# EAGLE design FuseReset_0.1 (EAGLE 7.2.1)
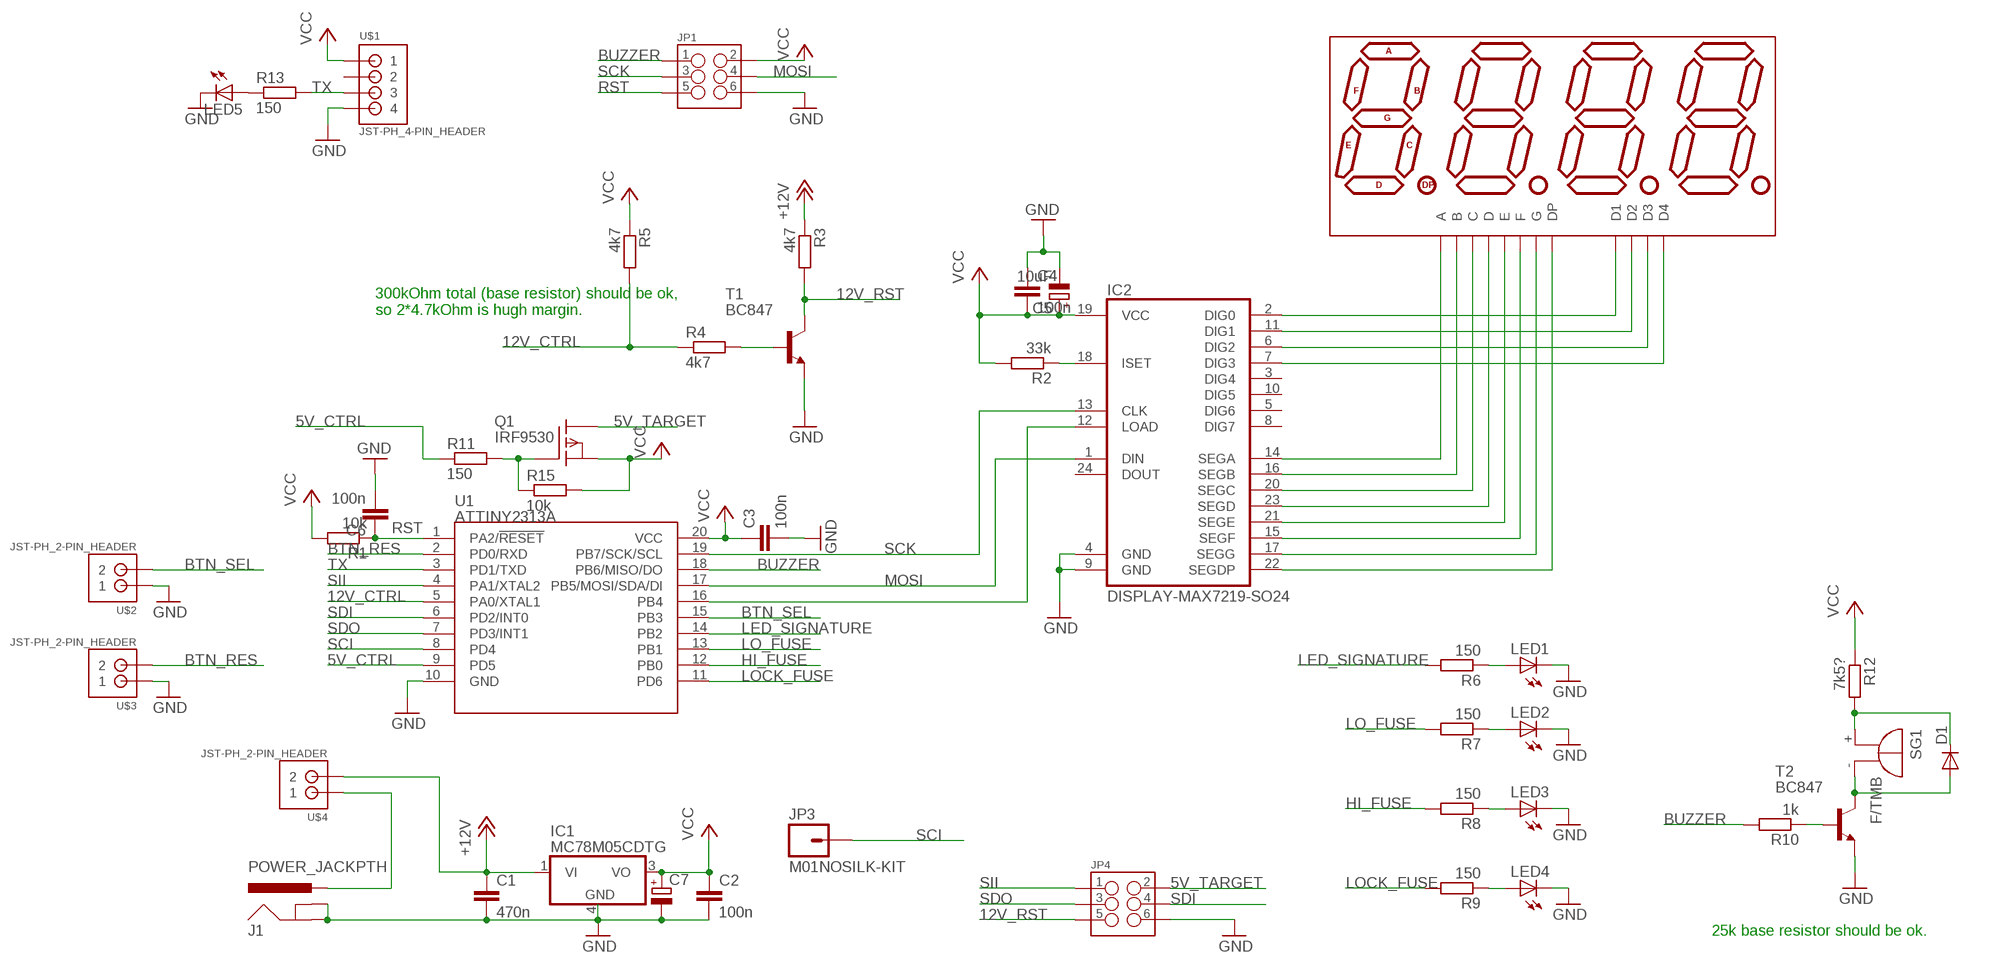
[diagram p0: schematic, sheet 1]

## Parts
C1  470n  C-EUC0805  [C0805]
C2  100n  C-EUC0805  [C0805]
C3  100n  C-EUC0805  [C0805]
C4  100n  C-EUC0805  [C0805]
C5  10uF  CPOL-EU153CLV-0405  [153CLV-0405]
C6  100n  C-EUC0805  [C0805]
C7  CPOL-EUE2-5  [E2-5]
D1  DIODE-DO-214AC  [DO-214AC]
DISP2  7-SEGMENT-4DIGIT-COUNTER  [7-SEGMENT-4DIGIT-COUNTER-0.36"]
IC1  MC78M05CDTG  [DPACK_3]
IC2  DISPLAY-MAX7219-SO24  [SO24L]
J1  POWER_JACKPTH  [POWER_JACK_PTH]
JP1  M03X2SHROUD  [2X3-SHROUDED]
JP3  M01NOSILK-KIT  [1X01NS-KIT]
JP4  M03X2SHROUD  [2X3-SHROUDED]
LED1  LED3MM  [LED3MM]
LED2  LED3MM  [LED3MM]
LED3  LED3MM  [LED3MM]
LED4  LED3MM  [LED3MM]
LED5  LED-0805  [LED-805]
Q1  IRF9530  [TO220]
R1  10k  R-EU_R0805  [R0805]
R2  33k  R-EU_R0805  [R0805]
R3  4k7  R-EU_R0805  [R0805]
R4  4k7  R-EU_R0805  [R0805]
R5  4k7  R-EU_R0805  [R0805]
R6  150  R-EU_R0805  [R0805]
R7  150  R-EU_R0805  [R0805]
R8  150  R-EU_R0805  [R0805]
R9  150  R-EU_R0805  [R0805]
R10  1k  R-EU_R0805  [R0805]
R11  150  R-EU_R0805  [R0805]
R12  7k5?  R-EU_R0805  [R0805]
R13  150  R-EU_R0805  [R0805]
R15  10k  R-EU_R0805  [R0805]
SG1  F/TMB  [F/TMB]
T1  BC847  [SOT23]
T2  BC847  [SOT23]
U1  ATTINY2313A  [SOP20W]
U$1  JST-PH_4-PIN_HEADER  [JST_B4B-PH_HEADER]
U$2  JST-PH_2-PIN_HEADER  [JST_B2B-PH_HEADER]
U$3  JST-PH_2-PIN_HEADER  [JST_B2B-PH_HEADER]
U$4  JST-PH_2-PIN_HEADER  [JST_B2B-PH_HEADER]

## Nets
5V_CTRL: R11.1 U1.9(PD5)
5V_TARGET: JP4.2 Q1.2(D)
12V_CTRL: R4.1 R5.2 U1.5(PA0/XTAL1)
12V_RST: JP4.5 R3.2 T1.3(C)
+12V: C1.1 IC1.1(VI) R3.1 U$4.P2
BTN_RES: U1.2(PD0/RXD) U$3.P2
BTN_SEL: U1.15(PB3) U$2.P2
BUZZER: JP1.1 R10.2 U1.18(PB6/MISO/DO)
GND: C1.2 C2.2 C3.2 C4.1 C5.- C6.2 C7.- IC1.4(GND) IC2.4(GND) IC2.9(GND) J1.GND J1.GNDBREAK JP1.6 JP4.6 LED1.K(C) LED2.K(C) LED3.K(C) LED4.K(C) LED5.C T1.2(E) T2.2(E) U1.10(GND) U$1.P4 U$2.P1 U$3.P1
HI_FUSE: R8.2 U1.12(PB0)
LED_SIGNATURE: R6.2 U1.14(PB2)
LO_FUSE: R7.2 U1.13(PB1)
LOCK_FUSE: R9.2 U1.11(PD6)
MOSI: IC2.1(DIN) JP1.4 U1.17(PB5/MOSI/SDA/DI)
N$1: DISP2.12(D1) IC2.2(DIG0)
N$2: DISP2.9(D2) IC2.11(DIG1)
N$3: DISP2.8(D3) IC2.6(DIG2)
N$4: DISP2.6(D4) IC2.7(DIG3)
N$5: DISP2.11(A) IC2.14(SEGA)
N$6: DISP2.7(B) IC2.16(SEGB)
N$7: DISP2.4(C) IC2.20(SEGC)
N$8: DISP2.2(D) IC2.23(SEGD)
N$9: DISP2.1(E) IC2.21(SEGE)
N$10: DISP2.10(F) IC2.15(SEGF)
N$11: DISP2.5(G) IC2.17(SEGG)
N$12: DISP2.3(DP) IC2.22(SEGDP)
N$13: IC2.18(ISET) R2.1
N$14: LED3.A R8.1
N$15: LED4.A R9.1
N$16: J1.PWR U$4.P1
N$17: LED2.A R7.1
N$18: LED1.A R6.1
N$19: R4.2 T1.1(B)
N$20: IC2.12(LOAD) U1.16(PB4)
N$23: R10.1 T2.1(B)
N$24: LED5.A R13.1
N$25: D1.2(A) SG1.- T2.3(C)
N$26: D1.1(C) R12.2 SG1.+
N$27: Q1.1(G) R11.2 R15.1
RST: C6.1 JP1.5 R1.1 U1.1(PA2/!RESET)
SCI: JP3.1 U1.8(PD4)
SCK: IC2.13(CLK) JP1.3 U1.19(PB7/SCK/SCL)
SDI: JP4.4 U1.6(PD2/INT0)
SDO: JP4.3 U1.7(PD3/INT1)
SII: JP4.1 U1.4(PA1/XTAL2)
TX: R13.2 U1.3(PD1/TXD) U$1.P3
VCC: C2.1 C3.1 C4.2 C5.+ C7.+ IC1.3(VO) IC2.19(VCC) JP1.2 Q1.3(S) R1.2 R2.2 R5.1 R12.1 R15.2 U1.20(VCC) U$1.P1
Unconnected: IC2.3(DIG4) IC2.5(DIG6) IC2.8(DIG7) IC2.10(DIG5) IC2.24(DOUT) U$1.P2

## Notes on the sheet
- 300kOhm total (base resistor) should be ok, 
  so 2*4.7kOhm is hugh margin.
- 25k base resistor should be ok.

## Library data of the parts
C1-C4 C6 = resistor:C-EU: CAPACITOR, European symbol
C5 = resistor:CPOL-EU: POLARIZED CAPACITOR, European symbol
C7 = rcl:CPOL-EU: POLARIZED CAPACITOR, European symbol
D1 = dp_devices:DIODE: Various Diode Packages
DISP2 = dea:7-SEGMENT-4DIGIT-COUNTER
IC1 = linear:MC78M: 500 mA Positive Voltage Regulators Source: Data sheet <http://www.onsemi.com/pub_link/Collateral/MC78M00-D.PDF>
IC2 = tidyeagle:DISPLAY-MAX7219: Maxim Serial LED Display Driver Datasheet: Full <http://datasheets.maxim-ic.com/en/ds/MAX7219-MAX7221.pdf> Application Notes: 7-Segment LED Displays used with this IC should be of the common cathode configuration. LED brightness is controlled by a resistor between ISET and VCC. A minimum value should be 9.53kΩ, which will typically allow a supply of 40mA. See Page 10/11 of the datasheet for more information on selecting a suitable resistor. A 10µF electrolytic bypass capacitor should used in addition to the standard 0.1µF ceramic capacitor to mitigate the effects of power supply ripple. Supports the following chips - MAX7219 MAX7221
J1 = SparkFun-Connectors:POWER_JACK: Power Jack This is the standard 5.5mm barrel jack for power. The PTH is the most common, proven, reliable, footprint. The Slot footprint only works if the mill layer is transmitted to the PCB fab house so be warned. Mating wall wart : TOL-00298 (and others); PROD_ID: PRT-00119
JP1 JP4 = SparkFun-Connectors:M03X2: 2x3 .1" header. Shrouded, with keying- CONN-10681 SMT- CONN-11415 Pogo pins- HW-11044; PROD_ID: CONN-10681
JP3 = SparkFun-Connectors:M01: Header 1 Standard 1-pin 0.1" header. Use with straight break away headers (SKU : PRT-00116), right angle break away headers (PRT-00553), swiss pins (PRT-00743), machine pins (PRT-00117), and female headers (PRT-00115).
LED1-LED4 = led:LED: LED OSRAM: - CHIPLED LG R971, LG N971, LY N971, LG Q971, LY Q971, LO R971, LY R971 LH N974, LH R974 LS Q976, LO Q976, LY Q976 LO Q996 - Hyper CHIPLED LW Q18S LB Q993, LB Q99A, LB R99A - SideLED LS A670, LO A670, LY A670, LG A670, LP A670 LB A673, LV A673, LT A673, LW A673 LH A674 LY A675 LS A676, LA A676, LO A676, LY A676, LW A676 LS A679, LY A679, LG A679 - Hyper Micro SIDELED® LS Y876, LA Y876, LO Y876, LY Y876 LT Y87S - SmartLED LW L88C, LW L88S LB L89C, LB L89S, LG L890 LS L89K, LO L89K, LY L89K LS L896, LA L896, LO L896, LY L896 - TOPLED LS T670, LO T670, LY T670, LG T670, LP T670 LSG T670, LSP T670, LSY T670, LOP T670, LYG T670 LG T671, LOG T671, LSG T671 LB T673, LV T673, LT T673, LW T673 LH T674 LS T676, LA T676, LO T676, LY T676, LB T676, LH T676, LSB T676, LW T676 LB T67C, LV T67C, LT T67C, LS T67K, LO T67K, LY T67K, LW E67C LS E67B, LA E67B, LO E67B, LY E67B, LB E67C, LV E67C, LT E67C LW T67C LS T679, LY T679, LG T679 LS T770, LO T770, LY T770, LG T770, LP T770 LB T773, LV T773, LT T773, LW T773 LH T774 LS E675, LA E675, LY E675, LS T675 LS T776, LA T776, LO T776, LY T776, LB T776 LHGB T686 LT T68C, LB T68C - Hyper Mini TOPLED® LB M676 - Mini TOPLED Santana® LG M470 LS M47K, LO M47K, LY M47K Source: http://www.osram.convergy.de LUXEON: - LUMILED® LXK2-PW12-R00, LXK2-PW12-S00, LXK2-PW14-U00, LXK2-PW14-V00 LXK2-PM12-R00, LXK2-PM12-S00, LXK2-PM14-U00 LXK2-PE12-Q00, LXK2-PE12-R00, LXK2-PE12-S00, LXK2-PE14-T00, LXK2-PE14-U00 LXK2-PB12-K00, LXK2-PB12-L00, LXK2-PB12-M00, LXK2-PB14-N00, LXK2-PB14-P00, LXK2-PB14-Q00 LXK2-PR12-L00, LXK2-PR12-M00, LXK2-PR14-Q00, LXK2-PR14-R00 LXK2-PD12-Q00, LXK2-PD12-R00, LXK2-PD12-S00 LXK2-PH12-R00, LXK2-PH12-S00 LXK2-PL12-P00, LXK2-PL12-Q00, LXK2-PL12-R00 Source: www.luxeon.com KINGBRIGHT: KA-3528ASYC Source: www.kingbright.com
LED5 = dp_devices:LED: Light Emitting Diode
Q1 = transistor-fet:IRF9530: P-Channel Enhancement MOSFET (HEXFET); -100V; -12A; 0,3Ohm
R1-R13 R15 = resistor:R-EU_: RESISTOR, European symbol
SG1 = buzzer:F/TMB: BUZZER Source: Buerklin; OC_FARNELL: unknown; OC_NEWARK: unknown
T1 T2 = transistor:BC847: NPN TRANSISTOR
U1 = SparkFun-DigitalIC:ATTINY2313A: ATTINY2313A 2kB 20MHz I2C/SPI/UART; PROD_ID: IC-11305
U$1 = SRG:JST-PH_4-PIN_HEADER: 4-pin JST PH Shrouded Header, top entry P/N B4B-PH-K-S Mating connector PHR-4 Mating cable assembly: Sparkfun PRT-09916 <http://www.sparkfun.com/products/9916>
U$2-U$4 = SRG:JST-PH_2-PIN_HEADER: 2-pin JST PH Shrouded Header, top entry P/N B2B-PH-K-S Mating connector PHR-2 Mating cable assembly: Sparkfun PRT-09914 <http://www.sparkfun.com/products/9914>

## Board
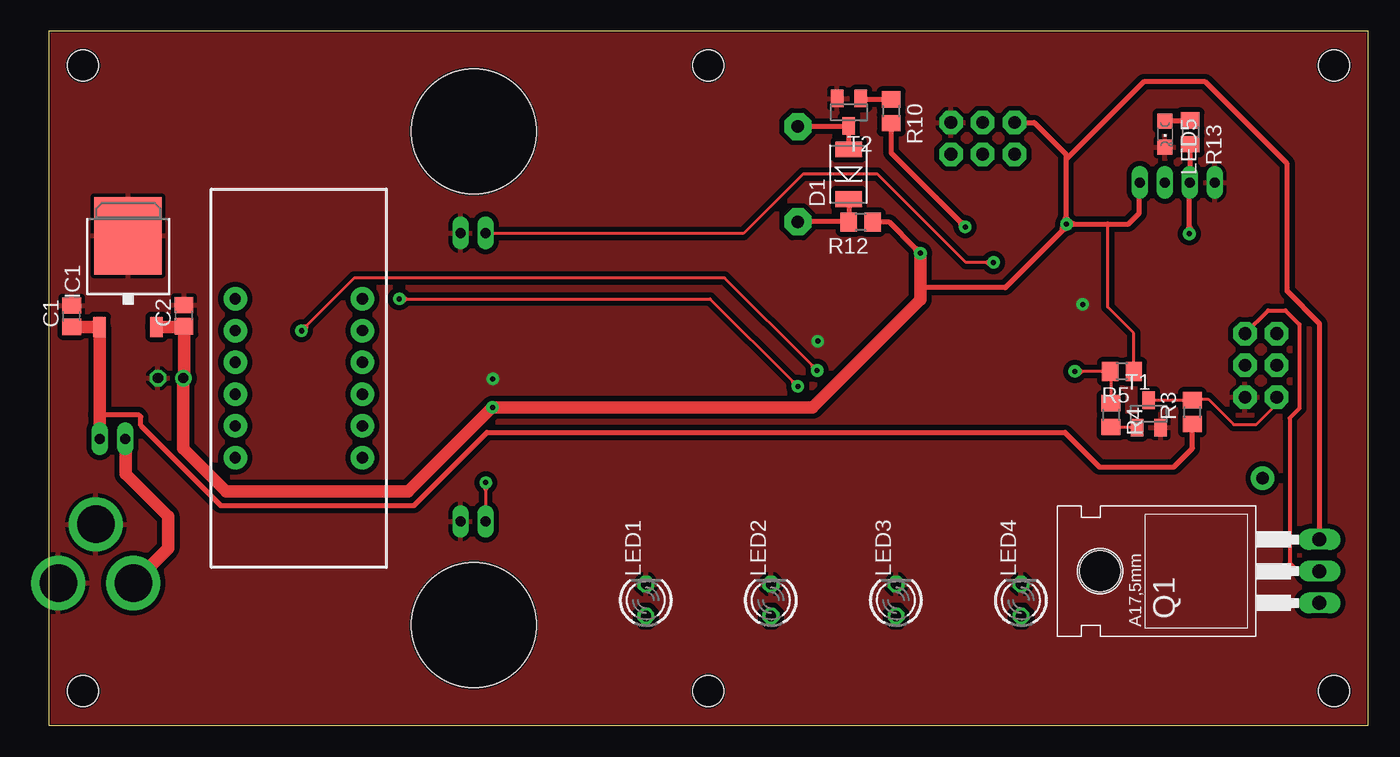
[diagram p1: board, top side]
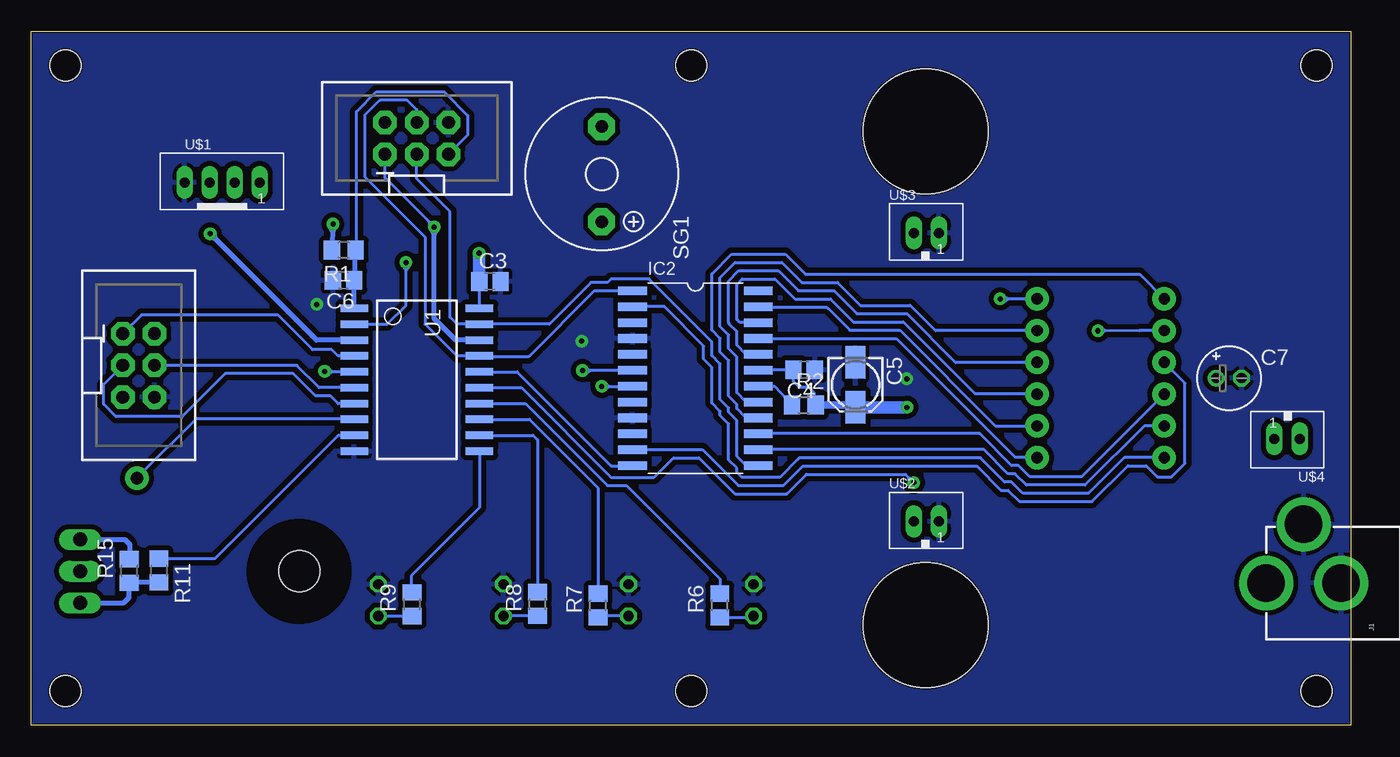
[diagram p2: board, bottom side, seen from below]

Size 105.5 x 55.5 mm. Coordinates in mm from the lower left corner, seen from the top.
Outline: 0,0 105.5,0 105.5,55.5 0,55.5 0,0
Copper layers (1*16): Top 0.035mm / dielectric 1.5mm / Bottom 0.035mm
Design rules "DesignRule_Home *": minimum track width 8mil, minimum drill 0.4mm, track to track 16mil, track to pad 16mil, pad to pad 10mil, via to via 10mil, smd to smd 8mil, copper to edge 5mil, drill to drill 8mil, minimum pad ring 10mil, minimum via ring 12mil, stop-mask expansion 4mil, vias tented up to drill 0mil, thermal gap 12mil
Holes 2.5 mm at 2.75,2.75 2.75,52.75 102.75,52.75 102.75,2.75 52.75,2.75 52.75,52.75
Holes 10 mm at 34,8 34,47.5
bKeepout: area 0.2,0.2 to 5.2,5.2; area 0.2,50.2 to 5.2,55.2; area 50.2,0.2 to 55.2,5.2; area 50.2,50.2 to 55.2,55.2; area 100.2,50.2 to 105.2,55.2; area 100.2,0.2 to 105.2,5.2

### Footprints (pad centres in the part's own frame; a part is rotated, then mirrored left to right if it is on the bottom)
C0805 = smd 1.3 x 1.5: 1 -0.85,0; 2 0.85,0
153CLV-0405 = smd 2.6 x 1.6: + 1.8,0; - -1.8,0
E2-5 = drill 0.813 pad 1.27: + -1.016,0 | drill 0.813 pad 1.27 octagon: - 1.016,0
DO-214AC = smd 1.27 x 2.1: 1 -1.98,0; 2 1.98,0
7-SEGMENT-4DIGIT-COUNTER-0.36" = drill 0.9 pad 1.88: 1 -6.35,-5.08; 2 -3.81,-5.08; 3 -1.27,-5.08; 4 1.27,-5.08; 5 3.81,-5.08; 6 6.35,-5.08; 7 6.35,5.08; 8 3.81,5.08; 9 1.27,5.08; 10 -1.27,5.08; 11 -3.81,5.08; 12 -6.35,5.08
DPACK_3 = smd 1 x 1.6: 1 -2.28,-4.8; 3 2.28,-4.8 | smd 5.4 x 6.2: 4 0,2.5
SO24L = smd 0.686 x 2.286: 1 -6.985,-5.029; 2 -5.715,-5.029; 3 -4.445,-5.029; 4 -3.175,-5.029; 5 -1.905,-5.029; 6 -0.635,-5.029; 7 0.635,-5.029; 8 1.905,-5.029; 9 3.175,-5.029; 10 4.445,-5.029; 11 5.715,-5.029; 12 6.985,-5.029; 13 6.985,5.029; 14 5.715,5.029; 15 4.445,5.029; 16 3.175,5.029; 17 1.905,5.029; 18 0.635,5.029; 19 -0.635,5.029; 20 -1.905,5.029; 21 -3.175,5.029; 22 -4.445,5.029; 23 -5.715,5.029; 24 -6.985,5.029
POWER_JACK_PTH = drill 2.997 pad 4.318: GND 0,7.7; GNDBREAK 4.7,10.7; PWR 0,13.7
2X3-SHROUDED = drill 1.016 pad 1.88 octagon: 1 -1.27,2.54; 2 1.27,2.54; 3 -1.27,0; 4 1.27,0; 5 -1.27,-2.54; 6 1.27,-2.54
1X01NS-KIT = drill 1.016 pad 1.88: 1 0,0
LED3MM = drill 0.813 octagon: A -1.27,0; K 1.27,0
LED-805 = smd 1.2 x 1.2: A 0,-1.05; C 0,1.05
TO220 = drill 1.118 long: 1 -2.54,-6.35; 2 0,-6.35; 3 2.54,-6.35 | hole 3.302: 0,11.176
R0805 = smd 1.3 x 1.5: 1 -0.95,0; 2 0.95,0
F/TMB = drill 1.016 pad 2.159 octagon: + 3.81,0; - -3.81,0
SOT23 = smd 1 x 1.4: 1 -0.95,-1.1; 2 0.95,-1.1; 3 0,1.1
SOP20W = smd 0.6 x 2.2: 1 -5.715,-5; 2 -4.445,-5; 3 -3.175,-5; 4 -1.905,-5; 5 -0.635,-5; 6 0.635,-5; 7 1.905,-5; 8 3.175,-5; 9 4.445,-5; 10 5.715,-5; 11 5.715,5; 12 4.445,5; 13 3.175,5; 14 1.905,5; 15 0.635,5; 16 -0.635,5; 17 -1.905,5; 18 -3.175,5; 19 -4.445,5; 20 -5.715,5
JST_B4B-PH_HEADER = drill 0.8 long: P1 2.98,0.048; P2 0.98,0.048; P3 -1.02,0.048; P4 -3.02,0.048
JST_B2B-PH_HEADER = drill 0.8 long: P1 1.075,0.048; P2 -0.925,0.048

### Placement (x,y rotation side)
C1  1.84,32.71 90 top
C2  10.82,32.76 90 top
C3  68.83,35.48 0 bottom
C4  43.71,28.42 180 bottom
C5  39.6,27.23 270 bottom
C6  80.53,35.57 180 bottom
C7  9.75,27.76 0 bottom
D1  63.96,44.07 90 top
DISP2  20,27.75 90 top
IC1  6.36,36.65 0 top
IC2  52.4,27.75 270 bottom
J1  -6.93,11.37 90 bottom
JP1  74.68,46.94 90 bottom
JP3  97.05,19.76 0 bottom
JP4  96.91,28.78 0 bottom
LED1  47.75,10 90 top
LED2  57.75,10 90 top
LED3  67.75,10 90 top
LED4  77.75,10 90 top
LED5  89.26,47.27 180 top
Q1  95.25,12.32 90 top
R1  80.52,38 180 bottom
R2  43.74,25.6 0 bottom
R3  91.44,25.04 90 top
R4  84.93,24.81 270 top
R5  85.81,28.3 180 top
R6  50.45,9.59 90 bottom
R7  60.18,9.58 90 bottom
R8  65.02,9.69 90 bottom
R9  75.06,9.68 90 bottom
R10  67.35,49.1 270 top
R11  95.3,12.37 270 bottom
R12  64.92,40.23 180 top
R13  91.26,47.42 270 top
R15  97.66,12.34 90 bottom
SG1  59.9,44.08 270 bottom
T1  87.95,24.9 0 top
T2  63.98,49.02 180 top
U1  74.67,27.63 270 bottom
U$1  90.21,43.36 0 bottom
U$2  34,16.26 0 bottom
U$3  34,39.32 0 bottom
U$4  5.03,22.96 180 bottom

### Tracks (layer width: path | path; a pad name or v marks a point on that pad's centre or on a via)
5V_CTRL
  Bottom 0.254: R11.1 90.83,13.31 80.95,23.19 79.83,23.19 U1.9
  Bottom 0.306: U1.9
5V_TARGET
  Top 0.254: JP4.2
  Top 0.306: JP4.2 97.49,33.17 98.88,33.17 100,32.05 100,25.35 99.21,24.56 99.21,12.98 99.87,12.32 Q1.2
12V_CTRL  (via drill 0.4)
  Top 0.254: 82.64,28.3 R5.2 84.93,28.3 R4.1 | 82.64,28.3 v82.04,28.3 | 82.64,28.3 82.28,28.59 v82.04,28.3 | 82.64,28.3 82.28,28 v82.04,28.3
  Bottom 0.254: v82.04,28.3 81.44,28.3 | 81.44,28.3 | 81.44,28.3 79.67,28.3 U1.5 | 81.44,28.3 | 81.44,28.3 81.8,28 | v82.04,28.3 81.8,28 | 81.44,28.3 81.8,28.59 | v82.04,28.3 81.8,28.59 | 81.44,28.3 81.8,28 | 81.8,28 | v82.04,28.3 81.8,28 | 81.44,28.3 81.8,28.59 | v82.04,28.3 81.8,28.59 | 81.44,28.3 81.8,28 | v82.04,28.3 81.8,28 | 81.44,28.3 81.8,28.59 | v82.04,28.3 81.8,28.59
12V_RST
  Top 0.254: R3.2 92.13,25.98 92.23,26.09 92.71,26.09 94.74,24.05 96.55,24.05 98.17,25.68 JP4.5 | R3.2 | R3.2 87.95,25.98 T1.3
+12V
  Top 0.406: 91.29,24.08 91.42,24.08 R3.1 91.44,22.15 89.94,20.65 84.02,20.65 81.25,23.42 35.05,23.42 29.21,17.58 13.74,17.58 7.44,23.88 7.44,23.9 7.37,23.98 7.37,24.66 7.19,24.84 4.08,24.84
  Top 1.016: C1.1 IC1.1 4.08,24.84 4.08,22.94 U$4.P2
BTN_RES  (via drill 0.4)
  Top 0.254: v75.54,37.01 74.94,37.01 | 74.94,37.01 | 74.94,37.01 73.33,37.01 66.27,44.07 60.3,44.07 55.55,39.32 34.97,39.32 U$3.P2 | 35.03,39.47 U$3.P2 | 74.94,37.01 75.3,37.3 | 75.3,37.3 | U$3.P2 | 74.94,37.01 | 74.94,37.01 75.3,36.71 | 75.3,36.71 | 74.94,37.01 75.3,36.71 | v75.54,37.01 75.3,36.71 | 74.94,37.01 75.3,37.3 | 75.3,37.3 | v75.54,37.01 75.3,37.3 | 74.94,37.01 75.3,36.71 | 75.3,36.71 | 75.3,36.71 | v75.54,37.01 75.3,36.71 | 74.94,37.01 75.3,37.3 | v75.54,37.01 75.3,37.3 | 74.94,37.01 75.3,36.71 | v75.54,37.01 75.3,36.71 | 74.94,37.01 75.3,37.3 | 75.3,37.3 | v75.54,37.01 75.3,37.3 | 74.94,37.01 75.3,36.71 | v75.54,37.01 75.3,36.71 | 74.94,37.01 75.3,37.3 | v75.54,37.01 75.3,37.3
  Bottom 0.254: U1.2 77.04,32.08 75.54,33.58 75.54,36.41 | 75.54,36.41 | 75.54,36.41 v75.54,37.01 | 75.25,36.77 | 75.25,36.77 | 75.54,36.41 75.83,36.77 | 75.54,36.41 75.83,36.77 | 75.83,36.77 | v75.54,37.01 75.83,36.77 | 75.54,36.41 75.25,36.77 | v75.54,37.01 75.25,36.77 | 75.25,36.77 | 75.54,36.41 75.83,36.77 | v75.54,37.01 75.83,36.77 | 75.54,36.41 75.25,36.77 | 75.25,36.77 | v75.54,37.01 75.25,36.77 | 75.54,36.41 75.83,36.77 | v75.54,37.01 75.83,36.77 | 75.54,36.41 | 75.54,36.41 75.25,36.77 | v75.54,37.01 75.25,36.77 | 75.54,36.41 75.83,36.77 | v75.54,37.01 75.83,36.77 | 75.54,36.41 75.25,36.77 | v75.54,37.01 75.25,36.77
BTN_SEL  (via drill 0.4)
  Top 0.254: v34.95,19.41 34.92,19.38 34.92,18.81 | 34.92,18.81 U$2.P2 | 34.92,18.81 35.23,19.16 v34.95,19.41 | 34.92,18.81 34.65,19.18 v34.95,19.41
  Bottom 0.254: U1.15 69.65,27 66.32,27 59.16,19.84 55.7,19.84 54.15,21.39 52.12,21.39 49.25,18.52 45.09,18.52 43.54,20.07 35.61,20.07 35.38,19.83 | v34.95,19.41 35.38,19.83 | 35.38,19.83 34.91,19.78 v34.95,19.41 | 35.38,19.83 35.33,19.37 v34.95,19.41
BUZZER  (via drill 0.4)
  Top 0.406: 72.86,40.28 v73.28,39.85 | R10.2 67.35,45.78 72.86,40.28 | 72.86,40.28 72.99,39.77 v73.28,39.85 | 72.86,40.28 73.36,40.14 v73.28,39.85
  Bottom 0.254: v73.28,39.85 73.7,40.28 | 73.7,40.28 77.22,43.79 JP1.1 | 73.7,40.28 73.24,40.23 v73.28,39.85 | 73.7,40.28 73.66,39.81 v73.28,39.85
  Bottom 0.406: U1.18 71.57,30.8 73.28,32.51 73.28,39.25 | 73.28,39.25 | 73.28,39.25 v73.28,39.85 | 73.28,39.25 73.02,39.7 | 73.28,39.25 73.54,39.7 | 73.28,39.25 73.02,39.7 | v73.28,39.85 73.02,39.7 | 73.28,39.25 73.54,39.7 | 73.28,39.25 73.02,39.7 | 73.28,39.25 73.54,39.7 | v73.28,39.85 73.54,39.7 | 73.28,39.25 | 73.28,39.25 73.02,39.7 | v73.28,39.85 73.02,39.7 | 73.28,39.25 73.54,39.7 | v73.28,39.85 73.54,39.7 | 73.28,39.25 73.02,39.7 | v73.28,39.85 73.02,39.7
GND  (via drill 0.4)
  other vias: 35.5,27.7 61.49,30.71 82.68,33.66
  pour Bottom: 0,0 0,55.5 105.5,55.5 105.5,0
  pour Top: 0,0 0,55.5 105.5,55.5 105.5,0
HI_FUSE
  Bottom 0.254: U1.12 69.65,23.19 65.37,23.19 65.02,22.84 R8.2
LED_SIGNATURE
  Bottom 0.254: U1.14 69.65,25.73 65.99,25.73 59.44,19.18 57.91,19.18 50.44,11.71 R6.2
LO_FUSE
  Bottom 0.254: U1.13 69.65,24.46 65.66,24.46 60.2,19 60.2,10.54 R7.2
LOCK_FUSE
  Bottom 0.254: U1.11 69.67,17.4 75.13,11.94 75.13,10.7 R9.2
MOSI
  Bottom 0.254: IC2.1 60.49,34.73 65.76,29.46 69.6,29.46 U1.17 | 69.77,29.54 71.48,29.54 74.02,32.08 74.02,39.04 78.84,43.87 78.84,48.79 77.65,49.99 75.44,49.99 74.68,49.23 JP1.4
  Bottom 0.406: 69.77,29.54 U1.17
N$1
  Bottom 0.254: 57.4,33.48 IC2.2 | DISP2.12 14.94,21.41 18.11,21.41 20.98,18.54 26.21,18.54 27.13,19.46 27.69,19.46 29.62,21.39 44.12,21.39 44.2,21.29 45.64,19.84 48.69,19.84 49.1,20.24 49.1,20.57 49.72,21.2 49.76,21.23 49.76,21.72 49.76,24.11 50.42,24.77 50.42,25.09 51.08,25.76 51.08,28.63 51.74,29.29 51.74,30.33 54.89,33.48 57.28,33.48 IC2.2 | 57.39,33.43 IC2.2
N$2
  Bottom 0.254: IC2.11 57.4,22.05 51.84,22.05 48.97,19.18 45.36,19.18 43.81,20.73 29.9,20.73 27.96,18.8 27.41,18.8 26.49,17.88 20.7,17.88 17.83,20.75 16.36,20.75 15.47,19.86 14.35,19.86 13.26,20.95 13.26,27.36 14.91,29.01 DISP2.9
N$3  (via drill 0.4)
  Top 0.254: v20.22,31.55 20.64,31.97 | 20.64,31.97 | 20.64,31.97 24.43,35.76 54.05,35.76 61.02,28.8 | v61.44,28.37 61.02,28.8 | 20.64,31.97 20.18,31.92 | 20.64,31.97 20.59,31.51 | v20.22,31.55 20.59,31.51 | v20.22,31.55 19.98,31.25 | v20.22,31.55 19.98,31.84 | 20.64,31.97 20.18,31.92 | v20.22,31.55 20.18,31.92 | 20.64,31.97 20.18,31.92 | v20.22,31.55 20.18,31.92 | 20.64,31.97 20.59,31.51 | v20.22,31.55 20.59,31.51 | 61.02,28.8 61.07,28.33 v61.44,28.37 | 61.02,28.8 61.48,28.75 v61.44,28.37
  Bottom 0.254: 57.44,28.4 IC2.6 57.44,28.37 60.84,28.37 | DISP2.8 16.9,31.56 v20.22,31.55 | 60.84,28.37 | 60.84,28.37 v61.44,28.37 | 19.98,31.25 | 60.84,28.37 61.2,28.66 | 61.2,28.66 | 19.62,31.55 19.98,31.25 | v20.22,31.55 19.98,31.25 | 19.62,31.55 19.98,31.84 | v20.22,31.55 19.98,31.84 | 19.62,31.55 19.98,31.25 | v20.22,31.55 19.98,31.25 | 19.62,31.55 19.98,31.84 | v20.22,31.55 19.98,31.84 | 60.84,28.37 | 60.84,28.37 61.2,28.08 | 61.2,28.08 | 60.84,28.37 61.2,28.08 | v61.44,28.37 61.2,28.08 | 60.84,28.37 61.2,28.66 | 61.2,28.66 | v61.44,28.37 61.2,28.66 | 60.84,28.37 61.2,28.08 | 61.2,28.08 | 61.2,28.08 | v61.44,28.37 61.2,28.08 | 60.84,28.37 61.2,28.66 | v61.44,28.37 61.2,28.66 | 60.84,28.37 61.2,28.08 | v61.44,28.37 61.2,28.08 | 60.84,28.37 61.2,28.66 | 61.2,28.66 | v61.44,28.37 61.2,28.66 | 60.84,28.37 61.2,28.08 | v61.44,28.37 61.2,28.08 | 60.84,28.37 61.2,28.66 | v61.44,28.37 61.2,28.66
N$4  (via drill 0.4)
  Top 0.254: v28.03,34.1 28.63,34.1 | 28.63,34.1 | 28.63,34.1 52.9,34.1 59.47,27.53 | 59.47,27.53 v59.89,27.1 | 28.27,33.81 | 28.27,33.81 | 28.63,34.1 28.27,34.39 | 28.63,34.1 28.27,34.39 | 28.27,34.39 | v28.03,34.1 28.27,34.39 | 28.63,34.1 28.27,33.81 | v28.03,34.1 28.27,33.81 | 28.27,33.81 | 28.63,34.1 28.27,34.39 | v28.03,34.1 28.27,34.39 | 28.63,34.1 28.27,33.81 | 28.27,33.81 | v28.03,34.1 28.27,33.81 | 28.63,34.1 28.27,34.39 | v28.03,34.1 28.27,34.39 | 28.63,34.1 | 28.63,34.1 28.27,33.81 | v28.03,34.1 28.27,33.81 | 28.63,34.1 28.27,34.39 | v28.03,34.1 28.27,34.39 | 28.63,34.1 28.27,33.81 | v28.03,34.1 28.27,33.81 | 59.47,27.53 59.52,27.06 v59.89,27.1 | 59.47,27.53 59.93,27.48 v59.89,27.1
  Bottom 0.254: DISP2.6 27.43,34.1 | 27.43,34.1 | 27.43,34.1 v28.03,34.1 | v59.89,27.1 59.29,27.1 | 59.29,27.1 | 59.29,27.1 57.44,27.1 IC2.7 | 27.43,34.1 27.79,34.39 | 27.79,34.39 | 59.29,27.1 59.66,27.39 | 59.66,27.39 | 27.43,34.1 | 27.43,34.1 27.79,33.81 | 27.79,33.81 | 27.43,34.1 27.79,33.81 | v28.03,34.1 27.79,33.81 | 27.43,34.1 27.79,34.39 | 27.79,34.39 | v28.03,34.1 27.79,34.39 | 27.43,34.1 27.79,33.81 | 27.79,33.81 | 27.79,33.81 | v28.03,34.1 27.79,33.81 | 27.43,34.1 27.79,34.39 | v28.03,34.1 27.79,34.39 | 27.43,34.1 27.79,33.81 | v28.03,34.1 27.79,33.81 | 27.43,34.1 27.79,34.39 | 27.79,34.39 | v28.03,34.1 27.79,34.39 | 27.43,34.1 27.79,33.81 | v28.03,34.1 27.79,33.81 | 27.43,34.1 27.79,34.39 | v28.03,34.1 27.79,34.39 | 59.29,27.1 | 59.29,27.1 59.66,26.81 | 59.66,26.81 | 59.29,27.1 59.66,26.81 | v59.89,27.1 59.66,26.81 | 59.29,27.1 59.66,27.39 | 59.66,27.39 | v59.89,27.1 59.66,27.39 | 59.29,27.1 59.66,26.81 | 59.66,26.81 | 59.66,26.81 | v59.89,27.1 59.66,26.81 | 59.29,27.1 59.66,27.39 | v59.89,27.1 59.66,27.39 | 59.29,27.1 59.66,26.81 | v59.89,27.1 59.66,26.81 | 59.29,27.1 59.66,27.39 | 59.66,27.39 | v59.89,27.1 59.66,27.39 | 59.29,27.1 59.66,26.81 | v59.89,27.1 59.66,26.81 | 59.29,27.1 59.66,27.39 | v59.89,27.1 59.66,27.39
N$5
  Bottom 0.254: IC2.14 47.35,22.05 29.34,22.05 27.41,20.12 26.85,20.12 25.93,19.2 21.26,19.2 16.51,23.95 14.94,23.95 DISP2.11
N$6
  Bottom 0.254: IC2.16 47.37,24.59 48.36,24.59 49.1,25.32 49.1,25.65 49.76,26.31 49.76,29.18 50.42,29.84 50.42,30.94 51.08,31.6 51.08,36.09 49.51,37.67 45.21,37.67 43.61,36.07 16.89,36.07 DISP2.7
N$7
  Bottom 0.254: IC2.20 48.36,29.67 49.1,30.4 49.1,31.5 49.71,32.11 49.71,32.16 49.76,32.21 49.76,35.53 48.95,36.35 45.77,36.35 44.17,34.75 41.33,34.75 39.5,32.92 35.51,32.92 31.6,29.01 25.09,29.01 DISP2.4
N$8
  Bottom 0.254: IC2.23 47.33,33.43 41.91,33.43 41.81,33.35 40.06,31.6 36.07,31.6 28.42,23.95 25.09,23.95 DISP2.2
N$9
  Bottom 0.254: 47.36,30.91 IC2.21 36.34,30.93 26.85,21.44 25.12,21.44 DISP2.1
N$10
  Bottom 0.254: IC2.15 47.35,23.32 29.67,23.32 27.13,20.78 26.57,20.78 25.65,19.86 21.54,19.86 14.94,26.47 DISP2.10
N$11
  Bottom 0.254: IC2.17 47.37,25.86 48.36,25.86 49.1,26.59 49.1,29.46 49.76,30.12 49.76,31.22 50.42,31.88 50.42,35.81 49.23,37.01 45.49,37.01 43.89,35.41 41.05,35.41 39.22,33.58 35.23,33.58 33.21,31.56 DISP2.5
N$12
  Bottom 0.254: IC2.22 48.87,32.21 49.1,32.44 49.1,35.26 48.67,35.69 46.05,35.69 44.45,34.09 41.6,34.09 39.78,32.26 35.79,32.26 30.05,26.52 25.22,26.52 DISP2.3 25.09,26.49
N$13
  Bottom 0.254: IC2.18 46.1,27.11 R2.1
N$14
  Bottom 0.254: R8.1 LED3.A
N$15
  Bottom 0.254: R9.1 LED4.A
N$16
  Top 1.016: U$4.P1 6.17,22.91 6.17,20.09 9.55,16.71 9.55,14.15 J1.PWR
N$17
  Bottom 0.254: LED2.A 60.08,8.73 R7.1
N$18
  Bottom 0.254: R6.1 47.84,8.64 LED1.A
N$19
  Top 0.254: R4.2 87,23.86 T1.1
N$20
  Bottom 0.254: U1.16 66.64,28.27 59.13,20.75 57.44,20.75
  Bottom 0.406: 57.44,20.75 IC2.12
N$21
  pour Top: 0,0 105.5,0 105.5,55.5 0,55.5
N$22
  pour Bottom: 0,0 105.5,0 105.5,55.5 0,55.5
N$23
  Top 0.406: T2.1 65,50.05 R10.1
N$24
  Top 0.406: R13.1 91.21,48.32 LED5.A
N$25
  Top 0.406: D1.2 63.96,47.9 T2.3 59.93,47.92 SG1.-
N$26
  Top 0.406: D1.1 63.97,42.07 R12.2 63.94,40.27 SG1.+
N$27
  Bottom 0.406: Q1.1 98.12,9.78 97.69,10.21 97.69,11.37 R15.1 97.64,11.42 R11.2
RST
  Bottom 0.254: R1.1 79.58,38.2 79.58,38.71 79.5,38.79 79.5,49.07 77.93,50.65 72.49,50.65 70.61,48.77 70.61,47.19 JP1.5
  Bottom 0.406: U1.1 79.68,33.36 C6.1 79.67,35.59 R1.1
SCI
  Bottom 0.254: U1.8 80.37,24.46 80.42,24.51 92.3,24.51 JP3.1
SCK
  Bottom 0.254: IC2.13 48.36,20.78 49.1,21.51 49.1,24.38 49.76,25.04 49.76,25.38 50.42,26.04 50.42,28.91 51.08,29.57 51.08,30.66 56.11,35.69 59.13,35.69 59.41,35.41 60.76,35.41 64.08,32.08 69.65,32.08 U1.19 | 70.69,32.08 71.48,32.08 72.03,32.64 72.03,41.07 74.68,43.72 JP1.3
  Bottom 0.406: 70.69,32.08 69.8,32.08 U1.19
SDI
  Bottom 0.254: JP4.4 84.28,28.78 82.5,27 U1.6
SDO
  Bottom 0.254: U1.7 80.97,25.73 81.58,26.34 82.78,26.34 84.56,28.12 89.99,28.12 93.42,24.69 98.73,24.69 99.72,25.68 99.72,27.25 98.2,28.78 JP4.3
SII
  Bottom 0.254: 98.17,31.34 JP4.1 96.69,32.82 85.78,32.82 83.01,30.05 81.48,30.05 80.97,29.54 U1.4
TX  (via drill 0.4)
  Top 0.406: v91.2,39.3 91.2,39.9 | 91.2,39.9 | U$1.P3 | 91.2,39.9 91.2,43.38 U$1.P3 | 91.2,39.9 90.94,39.45 | U$1.P3 91.26,43.44 R13.2 | 91.2,39.9 | 91.2,39.9 90.94,39.45 | 91.2,39.9 90.94,39.45 | v91.2,39.3 90.94,39.45 | 91.2,39.9 91.46,39.45 | 91.2,39.9 90.94,39.45 | v91.2,39.3 90.94,39.45 | 91.2,39.9 91.46,39.45 | v91.2,39.3 91.46,39.45 | 91.2,39.9 90.94,39.45 | 91.2,39.9 91.46,39.45 | 91.2,39.9 90.94,39.45 | v91.2,39.3 90.94,39.45 | 91.2,39.9 91.46,39.45 | v91.2,39.3 91.46,39.45
  Bottom 0.406: U1.3 82.7,30.8 90.78,38.88 | 90.78,38.88 v91.2,39.3 | 90.78,38.88 91.28,39.01 v91.2,39.3 | 90.78,38.88 90.91,39.38 v91.2,39.3
VCC  (via drill 0.4)
  Top 0.254: 84.68,40.08 84.68,33.43 86.76,31.35 R5.1
  Top 0.406: v81.38,40.08 81.98,40.08 | 81.98,40.08 | 81.98,40.08 84.68,40.08 86.33,40.08 87.2,40.95 87.2,43.38 U$1.P1 | JP1.2 78.79,48.21 81.33,45.67 81.33,45.24 | 81.33,45.24 81.33,40.68 | 81.33,40.68 81.33,40.13 v81.38,40.08 | 69.68,35 76.48,35 81.06,39.58 | 81.06,39.58 81.38,39.9 v81.38,40.08 | Q1.3 101.62,14.86 101.62,32.11 99.01,34.72 99.01,44.91 92.46,51.46 87.55,51.46 81.33,45.24 | 81.98,40.08 81.53,39.82 | v69.7,37.74 69.27,38.17 | 69.27,38.17 67.21,40.23 R12.1 | 69.27,38.17 69.41,37.67 v69.7,37.74 | 69.27,38.17 69.78,38.04 v69.7,37.74 | 81.98,40.08 81.53,40.34 | 81.98,40.08 81.53,39.82 | v81.38,40.08 81.53,39.82 | 81.98,40.08 81.53,40.34 | 81.98,40.08 81.53,39.82 | 81.98,40.08 81.53,40.34 | v81.38,40.08 81.53,40.34 | 81.98,40.08 | 81.98,40.08 81.53,39.82 | v81.38,40.08 81.53,39.82 | 81.98,40.08 81.53,40.34 | v81.38,40.08 81.53,40.34 | 81.98,40.08 81.53,39.82 | v81.38,40.08 81.53,39.82 | 81.33,40.68 81.11,40.21 v81.38,40.08 | 81.33,40.68 81.63,40.25 v81.38,40.08 | 81.06,39.58 81.52,39.81 v81.38,40.08 | 81.06,39.58 81.08,40.1 v81.38,40.08
  Top 1.016: v69.7,37.74 69.68,37.73 69.68,35 69.68,34.04 61.08,25.43 v35.48,25.43 35.46,25.43 28.73,18.7 14.2,18.7 10.77,22.13 C7.+ 10.82,27.76 C2.1 10.76,31.85 IC1.3
  Bottom 0.254: 42.89,26.23 R2.2 42.89,26.58 43.33,27.03 44.07,27.03 44.55,27.51 C4.2 47.33,28.42 IC2.19 | C3.1 69.68,33.36 U1.20
  Bottom 0.406: v81.38,40.08 81.37,40.07 R1.2 | Q1.3 98.02,14.86 97.61,14.45 97.61,13.35 R15.2 | v81.38,40.08 81.65,39.94 81.4,39.48 81.12,39.92 v81.38,40.08
  Bottom 0.61: C5.+ 39.77,25.6 R2.2
  Bottom 1.016: C5.+ v35.48,25.43 35.48,25.45 | C3.1 69.68,37.73 v69.7,37.74